# EAGLE schematic Greenhouse Schematics (EAGLE 9.6.2)
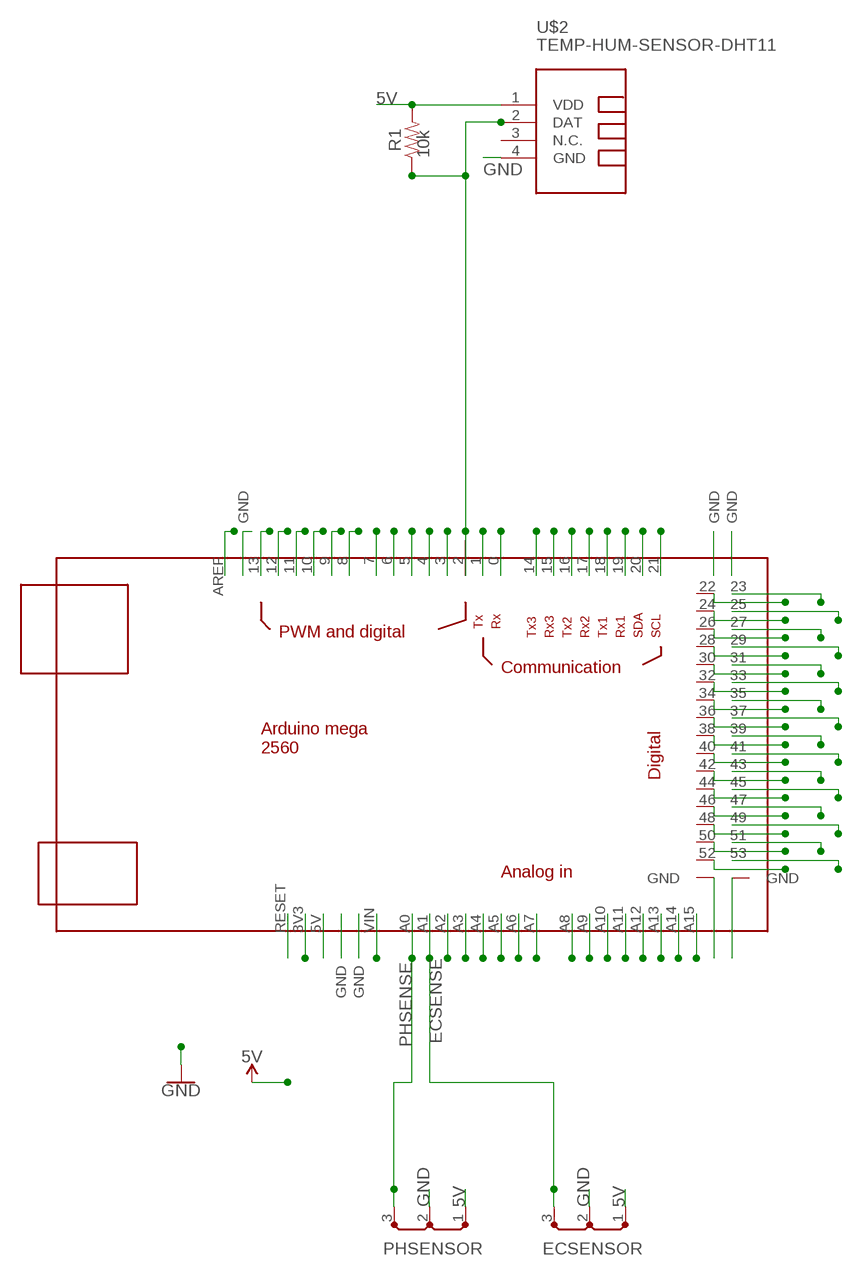
[diagram p0: schematic, sheet 1]

## Parts
BB1  TE4/3  [TE4/3]
BB2  TE4/3  [TE4/3]
R1  RESISTORAXIAL-0.3  [AXIAL-0.3]
U$1  MEGA_DEVICE  [MEGABOX]
U$2  TEMP-HUM-SENSOR-DHT11  [TEMP-HUM-SENSOR-DHT11]

## Nets
5V: BB1.1(P) BB2.1(P) R1.P$2 U$1.5V U$2.1(VDD)
ECSENSE: BB2.3(P) U$1.A1
GND: BB1.2(P) BB2.2(P) U$1.GND@1(GND) U$1.GND@2(GND) U$1.GND@3(GND) U$1.GND@4(GND) U$1.GND@5(GND) U$1.GND@6(GND) U$1.GND@7(GND) U$2.4(GND)
N$1: U$1.RESET
N$2: U$1.3V3
N$4: R1.P$1 U$1.2 U$2.2(DAT)
N$7: U$1.A2
N$8: U$1.A3
N$9: U$1.A4
N$10: U$1.A5
N$11: U$1.A6
N$12: U$1.A7
N$13: U$1.VIN
N$15: U$1.A8
N$16: U$1.A9
N$17: U$1.A10
N$18: U$1.A11
N$19: U$1.A12
N$20: U$1.A13
N$21: U$1.A14
N$22: U$1.A15
N$25: U$1.23
N$26: U$1.52
N$27: U$1.25
N$28: U$1.50
N$29: U$1.48
N$30: U$1.27
N$31: U$1.46
N$32: U$1.29
N$33: U$1.44
N$34: U$1.31
N$37: U$1.42
N$38: U$1.33
N$39: U$1.40
N$40: U$1.35
N$41: U$1.38
N$42: U$1.21
N$43: U$1.20
N$44: U$1.19
N$45: U$1.18
N$46: U$1.17
N$47: U$1.16
N$48: U$1.15
N$49: U$1.14
N$50: U$1.0
N$51: U$1.1
N$53: U$1.3
N$54: U$1.4
N$55: U$1.5
N$56: U$1.6
N$57: U$1.7
N$58: U$1.8
N$59: U$1.9
N$60: U$1.10
N$61: U$1.11
N$62: U$1.12
N$63: U$1.13
N$65: U$1.AREF
N$66: U$1.37
N$67: U$1.36
N$68: U$1.39
N$69: U$1.34
N$70: U$1.41
N$71: U$1.32
N$72: U$1.43
N$73: U$1.30
N$74: U$1.45
N$75: U$1.28
N$76: U$1.47
N$77: U$1.26
N$78: U$1.49
N$79: U$1.24
N$80: U$1.51
N$81: U$1.22
N$82: U$1.53
PHSENSE: BB1.3(P) U$1.A0
Unconnected: U$2.3(N.C.)

## Library data of the parts
BB1 BB2 = busbar:TE4/3: BUS BAR 3 connections, grid 4 TE
R1 = JMU_intro:RESISTOR: Generic Resistor Package; PROD_ID: 10k
U$1 = ArduinoMegaSymbol:MEGA_DEVICE: mega card as device
U$2 = diy-modules:TEMP-HUM-SENSOR-DHT11: DHT11 - digital humidity & temperature sensor DHT11 datasheet available here: https://akizukidenshi.com/download/ds/aosong/DHT11.pdf Click here to find device on ebay.com <http://www.ebay.com/sch/dht11+digital+sensor>